# Altium project Hexbot_STM32.PrjPcb
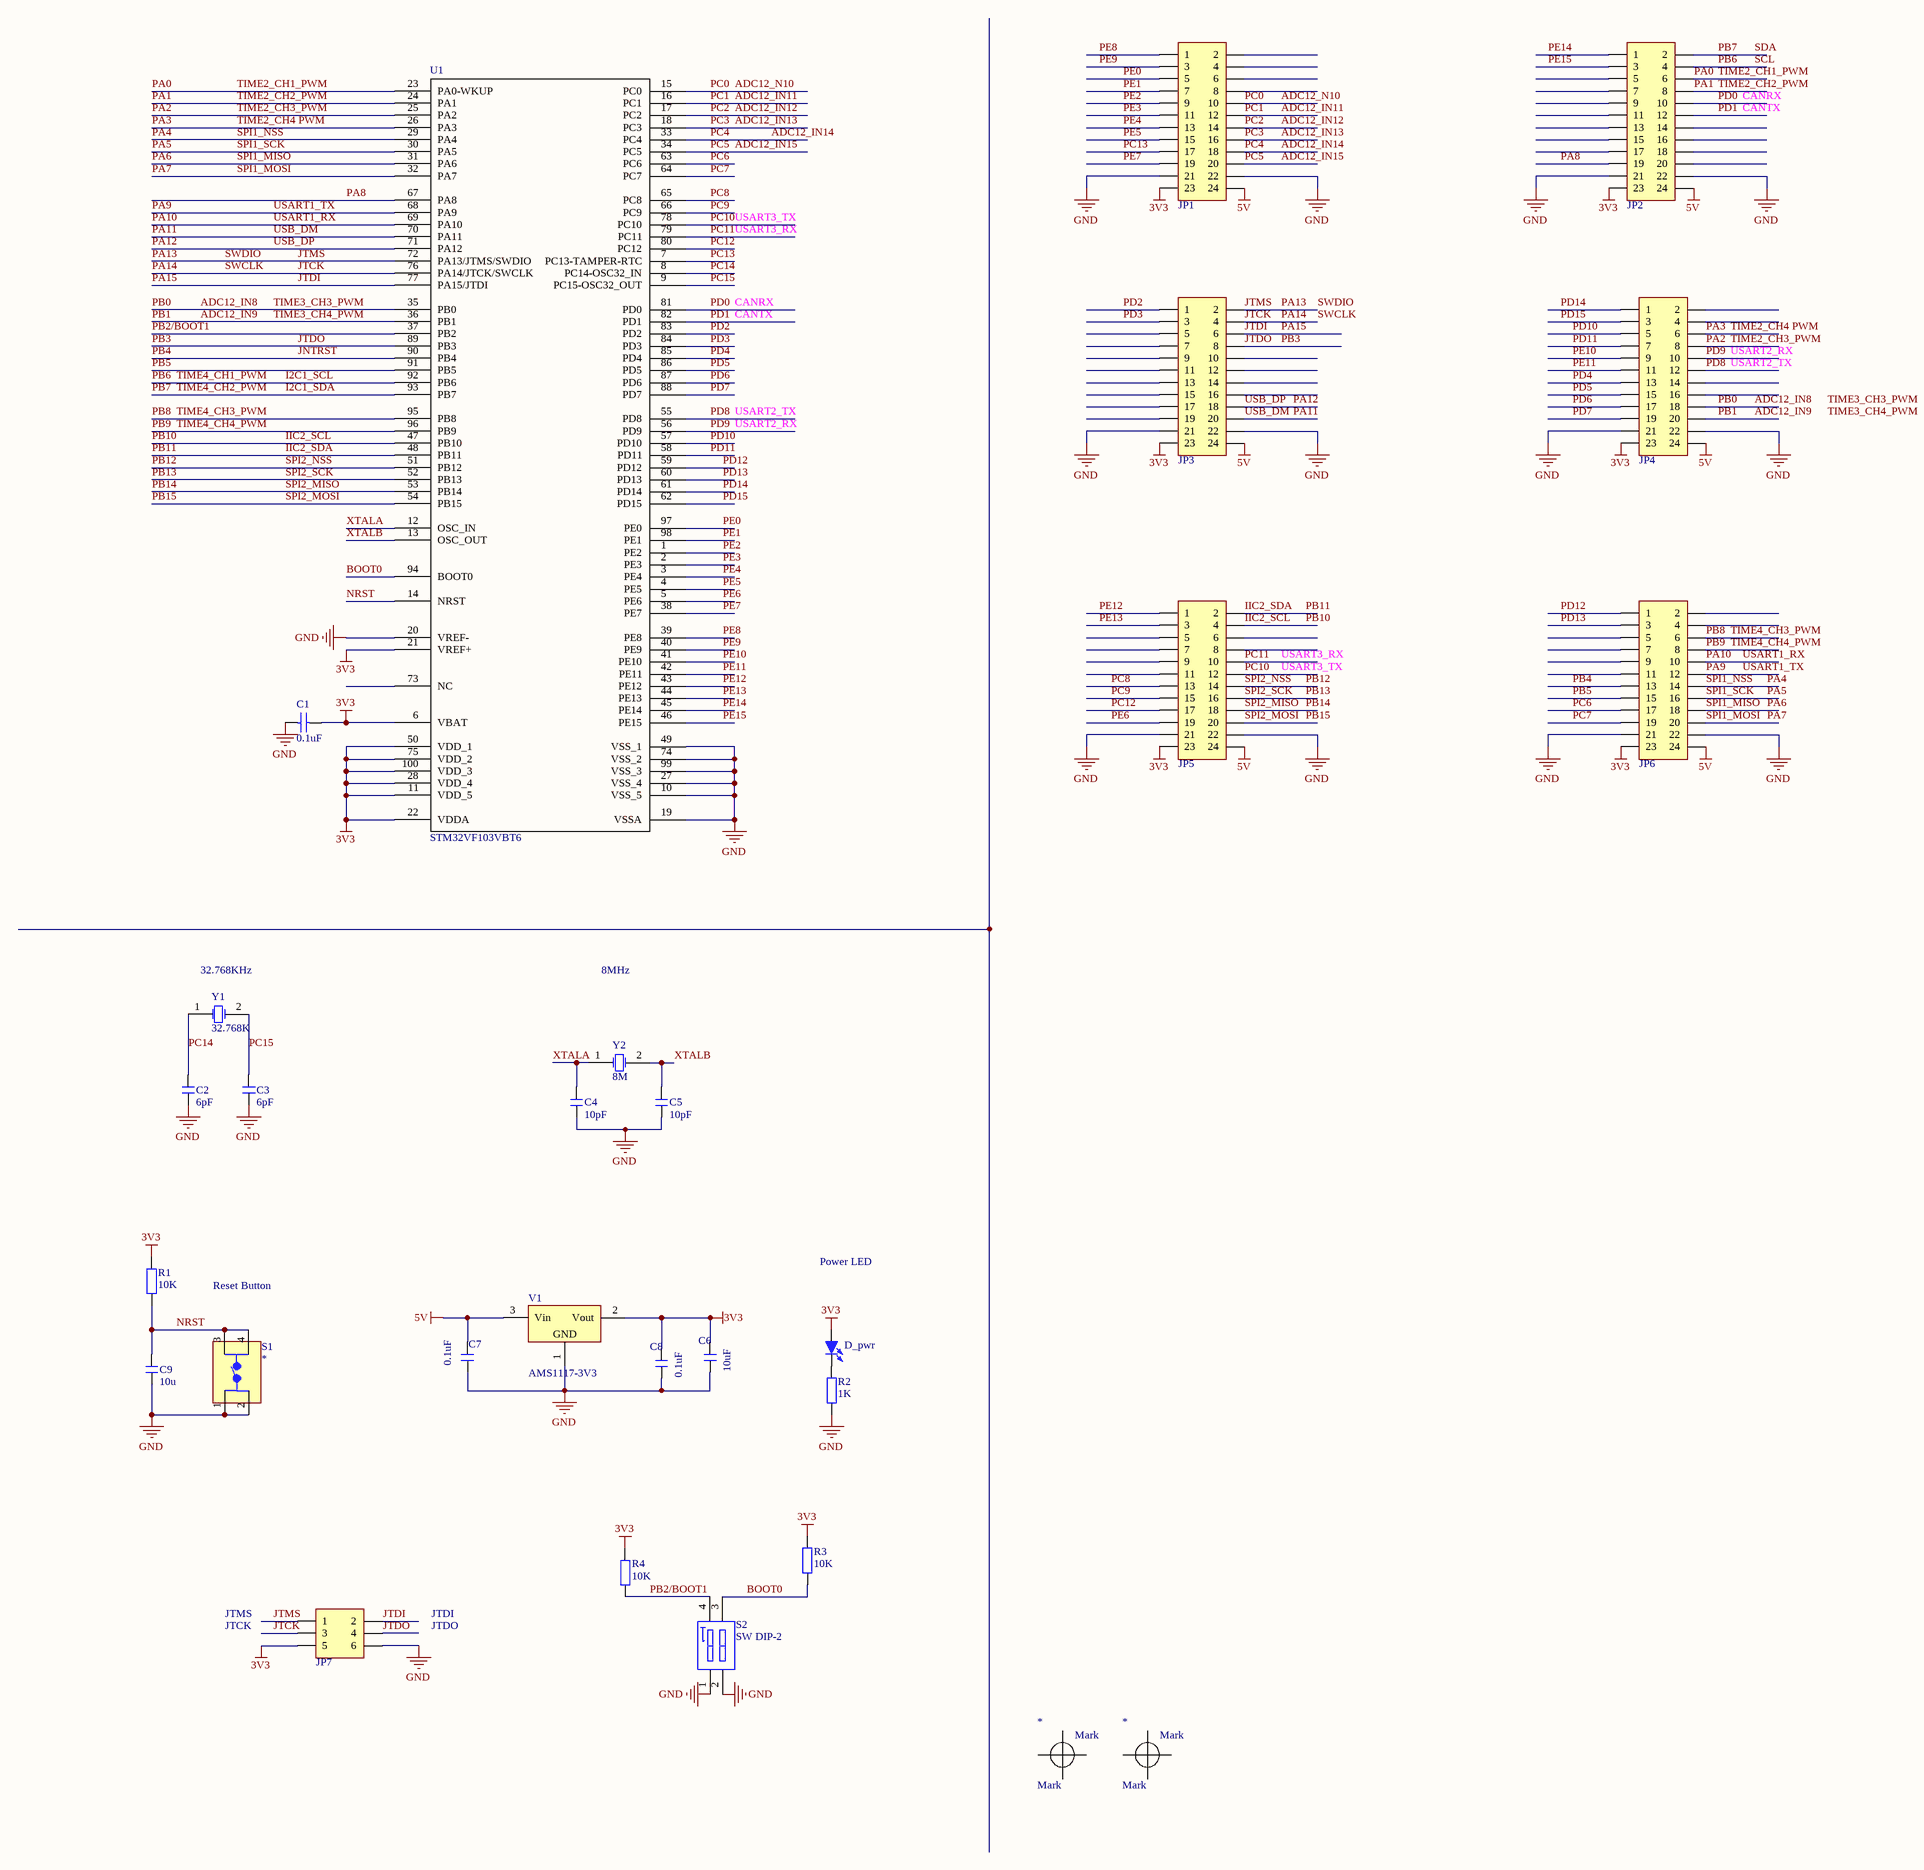
[diagram p0: Hexbot_Stm32.SchDoc]
1 sheet, 29 parts. Net scope: global (net labels, ports and power ports of the same name join across sheets).
Board file: Hexbot_Stm32.PcbDoc

## Sheet Hexbot_Stm32.SchDoc
size A2

### Parts
(Parts that share a designator on the sheet are numbered #1, #2 ... from top to bottom, then left to right.)
*#1  Mark  [Mark]  (no BOM)
*#2  Mark  [Mark]  (no BOM)
C1  value 0.1uF  [1608[0603]]  (hidden comment: Cap Semi)
C2  6pF  [C 0603_L]
C3  6pF  [C 0603_L]
C4  10pF  [C 0603_L]
C5  10pF  [C 0603_L]
C6  10uF  [C 0603_L]
C7  0.1uF  [C 0603_L]
C8  0.1uF  [C 0603_L]
C9  10u  [C 0603_L]
D_pwr  (no value)  [LED 0603R]
JP1  Header 2X11  [HDR2.54-WI-2x12P]  (value not drawn)
JP2  Header 2X11  [HDR2.54-WI-2x12P]  (value not drawn)
JP3  Header 2X11  [HDR2.54-WI-2x12P]  (value not drawn)
JP4  Header 2X11  [HDR2.54-WI-2x12P]  (value not drawn)
JP5  Header 2X11  [HDR2.54-WI-2x12P]  (value not drawn)
JP6  Header 2X11  [HDR2.54-WI-2x12P]  (value not drawn)
JP7  Header3X2  [HDR2.54-LI-2x3P]  (value not drawn)
R1  10K  [R 0603_L]
R2  1K  [R 0603_L]
R3  10K  [R 0603_L]
R4  10K  [R 0603_L]
S1  4-1437565-1  [BUTTON]  (value not drawn)
S2  SW DIP-2  [SMD-2]
U1  STM32VF103VBT6  [GDF103C8T6QFN100]
V1  AMS1117-3V3  [SOT223_L]
Y1  32.768K  [32.768KHZ]
Y2  8M  [8M]

### Nets
3V3: C1.2 C6.2 C8.2 D_pwr.1(A) JP1.23 JP2.23 JP3.23 JP4.23 JP5.23 JP6.23 JP7.5 R1.2 R3.2 R4.2 U1.6(VBAT) U1.11(VDD_5) U1.21(VREF+) U1.22(VDDA) U1.28(VDD_4) U1.50(VDD_1) U1.75(VDD_2) U1.100(VDD_3) V1.2(Vout)
5V: C7.2 JP1.24 JP2.24 JP3.24 JP4.24 JP5.24 JP6.24 V1.3(Vin)
GND: C1.1 C2.1 C3.1 C4.1 C5.1 C6.1 C7.1 C8.1 C9.1 JP1.21 JP1.22 JP2.21 JP2.22 JP3.21 JP3.22 JP4.21 JP4.22 JP5.21 JP5.22 JP6.21 JP6.22 JP7.6 R2.1 S1.1 S1.2 S2.1(A1) S2.2(A2) U1.10(VSS_5) U1.19(VSSA) U1.20(VREF-) U1.27(VSS_4) U1.49(VSS_1) U1.74(VSS_2) U1.99(VSS_3) V1.1(GND)
ADC12_IN8: JP4.18 U1.35(PB0)  [also labelled PB0, TIME3_CH3_PWM]
ADC12_IN9: JP4.20 U1.36(PB1)  [also labelled PB1, TIME3_CH4_PWM]
ADC12_IN11: JP1.12 U1.16(PC1)  [also labelled PC1]
ADC12_IN12: JP1.14 U1.17(PC2)  [also labelled PC2]
ADC12_IN13: JP1.16 U1.18(PC3)  [also labelled PC3]
ADC12_IN14: JP1.18 U1.33(PC4)  [also labelled PC4]
ADC12_IN15: JP1.20 U1.34(PC5)  [also labelled PC5]
ADC12_N10: JP1.10 U1.15(PC0)  [also labelled PC0]
BOOT0: R3.1 S2.3(B2) U1.94(BOOT0)
CANRX: JP2.10 U1.81(PD0)  [also labelled PD0]
CANTX: JP2.12 U1.82(PD1)  [also labelled PD1]
I2C1_SCL: JP2.4 U1.92(PB6)  [also labelled PB6, SCL, TIME4_CH1_PWM]
I2C1_SDA: JP2.2 U1.93(PB7)  [also labelled PB7, SDA, TIME4_CH2_PWM]
IIC2_SCL: JP5.4 U1.47(PB10)  [also labelled PB10]
IIC2_SDA: JP5.2 U1.48(PB11)  [also labelled PB11]
JNTRST: JP6.13 U1.90(PB4)  [also labelled PB4]
JTCK: JP3.4 JP7.3 U1.76(PA14/JTCK/SWCLK)  [also labelled PA14, SWCLK]
JTDI: JP3.6 JP7.2 U1.77(PA15/JTDI)  [also labelled PA15]
JTDO: JP3.8 JP7.4 U1.89(PB3)  [also labelled PB3]
JTMS: JP3.2 JP7.1 U1.72(PA13/JTMS/SWDIO)  [also labelled PA13, SWDIO]
NRST: C9.2 R1.1 S1.3 S1.4 U1.14(NRST)
PA0: JP2.6 U1.23(PA0-WKUP)  [also labelled TIME2_CH1_PWM]
PA1: JP2.8 U1.24(PA1)  [also labelled TIME2_CH2_PWM]
PA2: JP4.8 U1.25(PA2)  [also labelled TIME2_CH3_PWM]
PA3: JP4.6 U1.26(PA3)  [also labelled TIME2_CH4 PWM]
PA4: JP6.14 U1.29(PA4)  [also labelled SPI1_NSS]
PA5: JP6.16 U1.30(PA5)  [also labelled SPI1_SCK]
PA6: JP6.18 U1.31(PA6)  [also labelled SPI1_MISO]
PA7: JP6.20 U1.32(PA7)  [also labelled SPI1_MOSI]
PA8: JP2.19 U1.67(PA8)
PA9: JP6.12 U1.68(PA9)  [also labelled USART1_TX]
PA10: JP6.10 U1.69(PA10)  [also labelled USART1_RX]
PA11: JP3.20 U1.70(PA11)  [also labelled USB_DM]
PA12: JP3.18 U1.71(PA12)  [also labelled USB_DP]
PB2/BOOT1: R4.1 S2.4(B1) U1.37(PB2)
PB5: JP6.15 U1.91(PB5)
PB8: JP6.6 U1.95(PB8)  [also labelled TIME4_CH3_PWM]
PB9: JP6.8 U1.96(PB9)  [also labelled TIME4_CH4_PWM]
PB12: JP5.14 U1.51(PB12)  [also labelled SPI2_NSS]
PB13: JP5.16 U1.52(PB13)  [also labelled SPI2_SCK]
PB14: JP5.18 U1.53(PB14)  [also labelled SPI2_MISO]
PB15: JP5.20 U1.54(PB15)  [also labelled SPI2_MOSI]
PC6: JP6.17 U1.63(PC6)
PC7: JP6.19 U1.64(PC7)
PC8: JP5.13 U1.65(PC8)
PC9: JP5.15 U1.66(PC9)
PC10: JP5.12 U1.78(PC10)  [also labelled USART3_TX]
PC11: JP5.10 U1.79(PC11)  [also labelled USART3_RX]
PC12: JP5.17 U1.80(PC12)
PC13: JP1.17 U1.7(PC13-TAMPER-RTC)
PC14: C2.2 U1.8(PC14-OSC32_IN) Y1.1(OSC1)
PC15: C3.2 U1.9(PC15-OSC32_OUT) Y1.2(OSC2)
PD2: JP3.1 U1.83(PD2)
PD3: JP3.3 U1.84(PD3)
PD4: JP4.13 U1.85(PD4)
PD5: JP4.15 U1.86(PD5)
PD6: JP4.17 U1.87(PD6)
PD7: JP4.19 U1.88(PD7)
PD8: JP4.12 U1.55(PD8)  [also labelled USART2_TX]
PD9: JP4.10 U1.56(PD9)  [also labelled USART2_RX]
PD10: JP4.5 U1.57(PD10)
PD11: JP4.7 U1.58(PD11)
PD12: JP6.1 U1.59(PD12)
PD13: JP6.3 U1.60(PD13)
PD14: JP4.1 U1.61(PD14)
PD15: JP4.3 U1.62(PD15)
PE0: JP1.5 U1.97(PE0)
PE1: JP1.7 U1.98(PE1)
PE2: JP1.9 U1.1(PE2)
PE3: JP1.11 U1.2(PE3)
PE4: JP1.13 U1.3(PE4)
PE5: JP1.15 U1.4(PE5)
PE6: JP5.19 U1.5(PE6)
PE7: JP1.19 U1.38(PE7)
PE8: JP1.1 U1.39(PE8)
PE9: JP1.3 U1.40(PE9)
PE10: JP4.9 U1.41(PE10)
PE11: JP4.11 U1.42(PE11)
PE12: JP5.1 U1.43(PE12)
PE13: JP5.3 U1.44(PE13)
PE14: JP2.1 U1.45(PE14)
PE15: JP2.3 U1.46(PE15)
XTALA: C4.2 U1.12(OSC_IN) Y2.1(OSC1)
XTALB: C5.2 U1.13(OSC_OUT) Y2.2(OSC2)
NetD_pwr_2: D_pwr.2(K) R2.2

Not connected (* = marked no-connect by the designer): JP1 2 4 6 8; JP2 5 7 9 11 13 14 15 16 17 18 20; JP3 5 7 9 10 11 12 13 14 15 16 17 19; JP4 2 4 14 16; JP5 5 6 7 8 9 11; JP6 2 4 5 7 9 11; U1 73(NC)

### Notes on the sheet
- (near Y1) 32.768KHz
- 8MHz
- Reset Button
- Power LED
- JTCK
- JTMS
- JTDI
- JTDO
- Labels drawn without touching a wire or pin: TIME3_CH3_PWM, TIME3_CH4_PWM

### Library data of the parts
C1 = Cap Semi: Capacitor (Semiconductor SIM Model); Published: 8-Jun-2000; LatestRevisionDate: 29-May-2009; LatestRevisionNote: IPC-7351 Footprint Added.; PackageReference: C1206; Publisher: Altium Limited; PackageDescription: Chip Capacitor
C2-C5 C9 = C: 贴片电容; BOM名称: 无极性贴片电容; 淘宝ID: 封装库来自淘宝 ID：黄晶宝石; 联系售后，技术支持: https://shop463601444.taobao.com; 唯一出售店铺网址: https://shop463601444.taobao.com
C6-C8 = C: 贴片电容
D_pwr = LED-SMD: 贴片LED; 版权归属: 封装库来自淘宝 ID：黄晶宝石; BOM名称: 贴片LED; 学习资源: https://shop463601444.taobao.com
JP1-JP6 = Header 12X2: 12*2P接插件; 版权归属: 封装库来自淘宝卖家 ID：黄晶宝石; BOM名称: 12*2P接插件; 学习资源: https://shop463601444.taobao.com
JP7 = Header 3X2: 3*2P接插件; 版权归属: 封装库来自淘宝 ID：黄晶宝石; BOM名称: 3*2P接插件; 学习资源: https://shop463601444.taobao.com
R1-R4 = R: 贴片电阻; 版权归属: 来自淘宝 ID：黄晶宝石; 封装库来自淘宝卖家 ID：黄晶宝石: 其他店铺购入均为盗版，不享受售后技术支持服务，请立即申请退款; BOM名称: 贴片电阻; 联系售后: https://shop463601444.taobao.com
S1 = FSM4JSMA: Tactile Switch SPST-NO Top Actuated Surface Mount; Contact_Current_Rating: 50 mA; Configuration_Pole-Throw: Single Pole - Single Throw; MF: TE Connectivity; SnapEDA_Link: https://www.snapeda.com/parts/FSM4JSMA/TE%20Connectivity%20ALCOSWITCH%20Switches/view-part/543632/?ref=snap; Availability: Unavailable; TE_purchase_URL: https://www.te.com/usa-en/product-4-1437565-1.html?te_bu=Cor&te_type=disp&te_campaign=seda_glo_cor-seda-global-disp-prtnr-fy19-seda-model-bom-cta_sma-317_1&elqCampaignId=32493; MP: FSM4JSMA; EU_RoHS_Compliance: Compliant; Price: None; Value: *; Package: None; Comment_1: *
S2 = SW DIP-2: DIP Switch, 2 Position, SPST; Published: 24-Mar-1999; LatestRevisionDate: 17-Jul-2002; LatestRevisionNote: Re-released for DXP Platform.; PackageReference: DIP-4; Publisher: Altium Limited
U1 = GD32VF103VBT6
V1 = AMS1117: 三端稳压芯片; BOM名称: 稳压芯片; 淘宝ID: 封装库来自淘宝 ID：黄晶宝石; 欢迎光临淘宝店铺: https://shop463601444.taobao.com
Y1 Y2 = XTAL_1: Crystal Oscillator; Published: 8-Jun-2000; LatestRevisionDate: 17-Jul-2002; LatestRevisionNote: Re-released for DXP Platform.; PackageReference: R38; Publisher: Altium Limited; PackageDescription: Crystal, Thru-Hole; 2 Leads; Body 3.1 x 8.2 mm (Dia.xH)